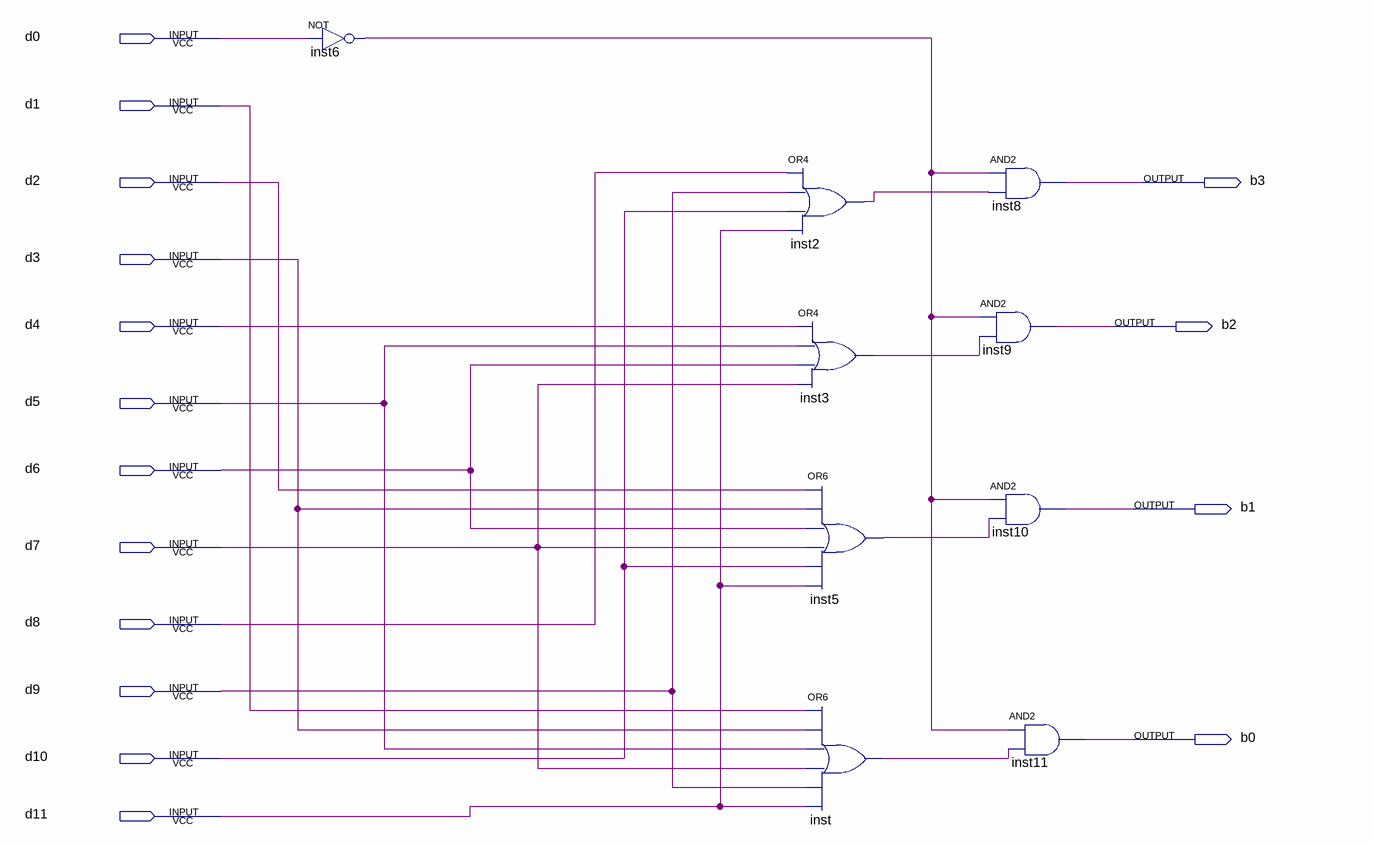
[diagram p0: schematic sheet]
// Quartus schematic week2_2.bdf as structural Verilog: 9 symbols, 16 pins
module week2_2 (
  input  d0,
  input  d1,
  input  d2,
  input  d3,
  input  d4,
  input  d5,
  input  d6,
  input  d7,
  input  d8,
  input  d9,
  input  d10,
  input  d11,
  output b3,
  output b2,
  output b1,
  output b0
);

  wire inst2_out, inst3_out, inst5_out, inst6_out, inst_out;

  not inst6 (inst6_out, d0);
  or inst2 (inst2_out, d8, d9, d10, d11);
  or inst3 (inst3_out, d4, d5, d6, d7);
  or inst5 (inst5_out, d2, d3, d6, d7, d10, d11);
  or inst (inst_out, d1, d3, d5, d7, d9, d11);
  and inst8 (b3, inst6_out, inst2_out);
  and inst9 (b2, inst6_out, inst3_out);
  and inst10 (b1, inst6_out, inst5_out);
  and inst11 (b0, inst6_out, inst_out);
endmodule
